# EasyEDA Pro project VS_Project_HW02.eprj

# Schematic VS_Schematic
Board Name: VS_Board; Create Date: 2025-04-22; Page Name: P1; Project Name: VS_Project_HW02; Schematic Name: VS_Schematic; Update Date: 2025-07-10; Company: OTCN; Page Size: A3; Version: V0.2
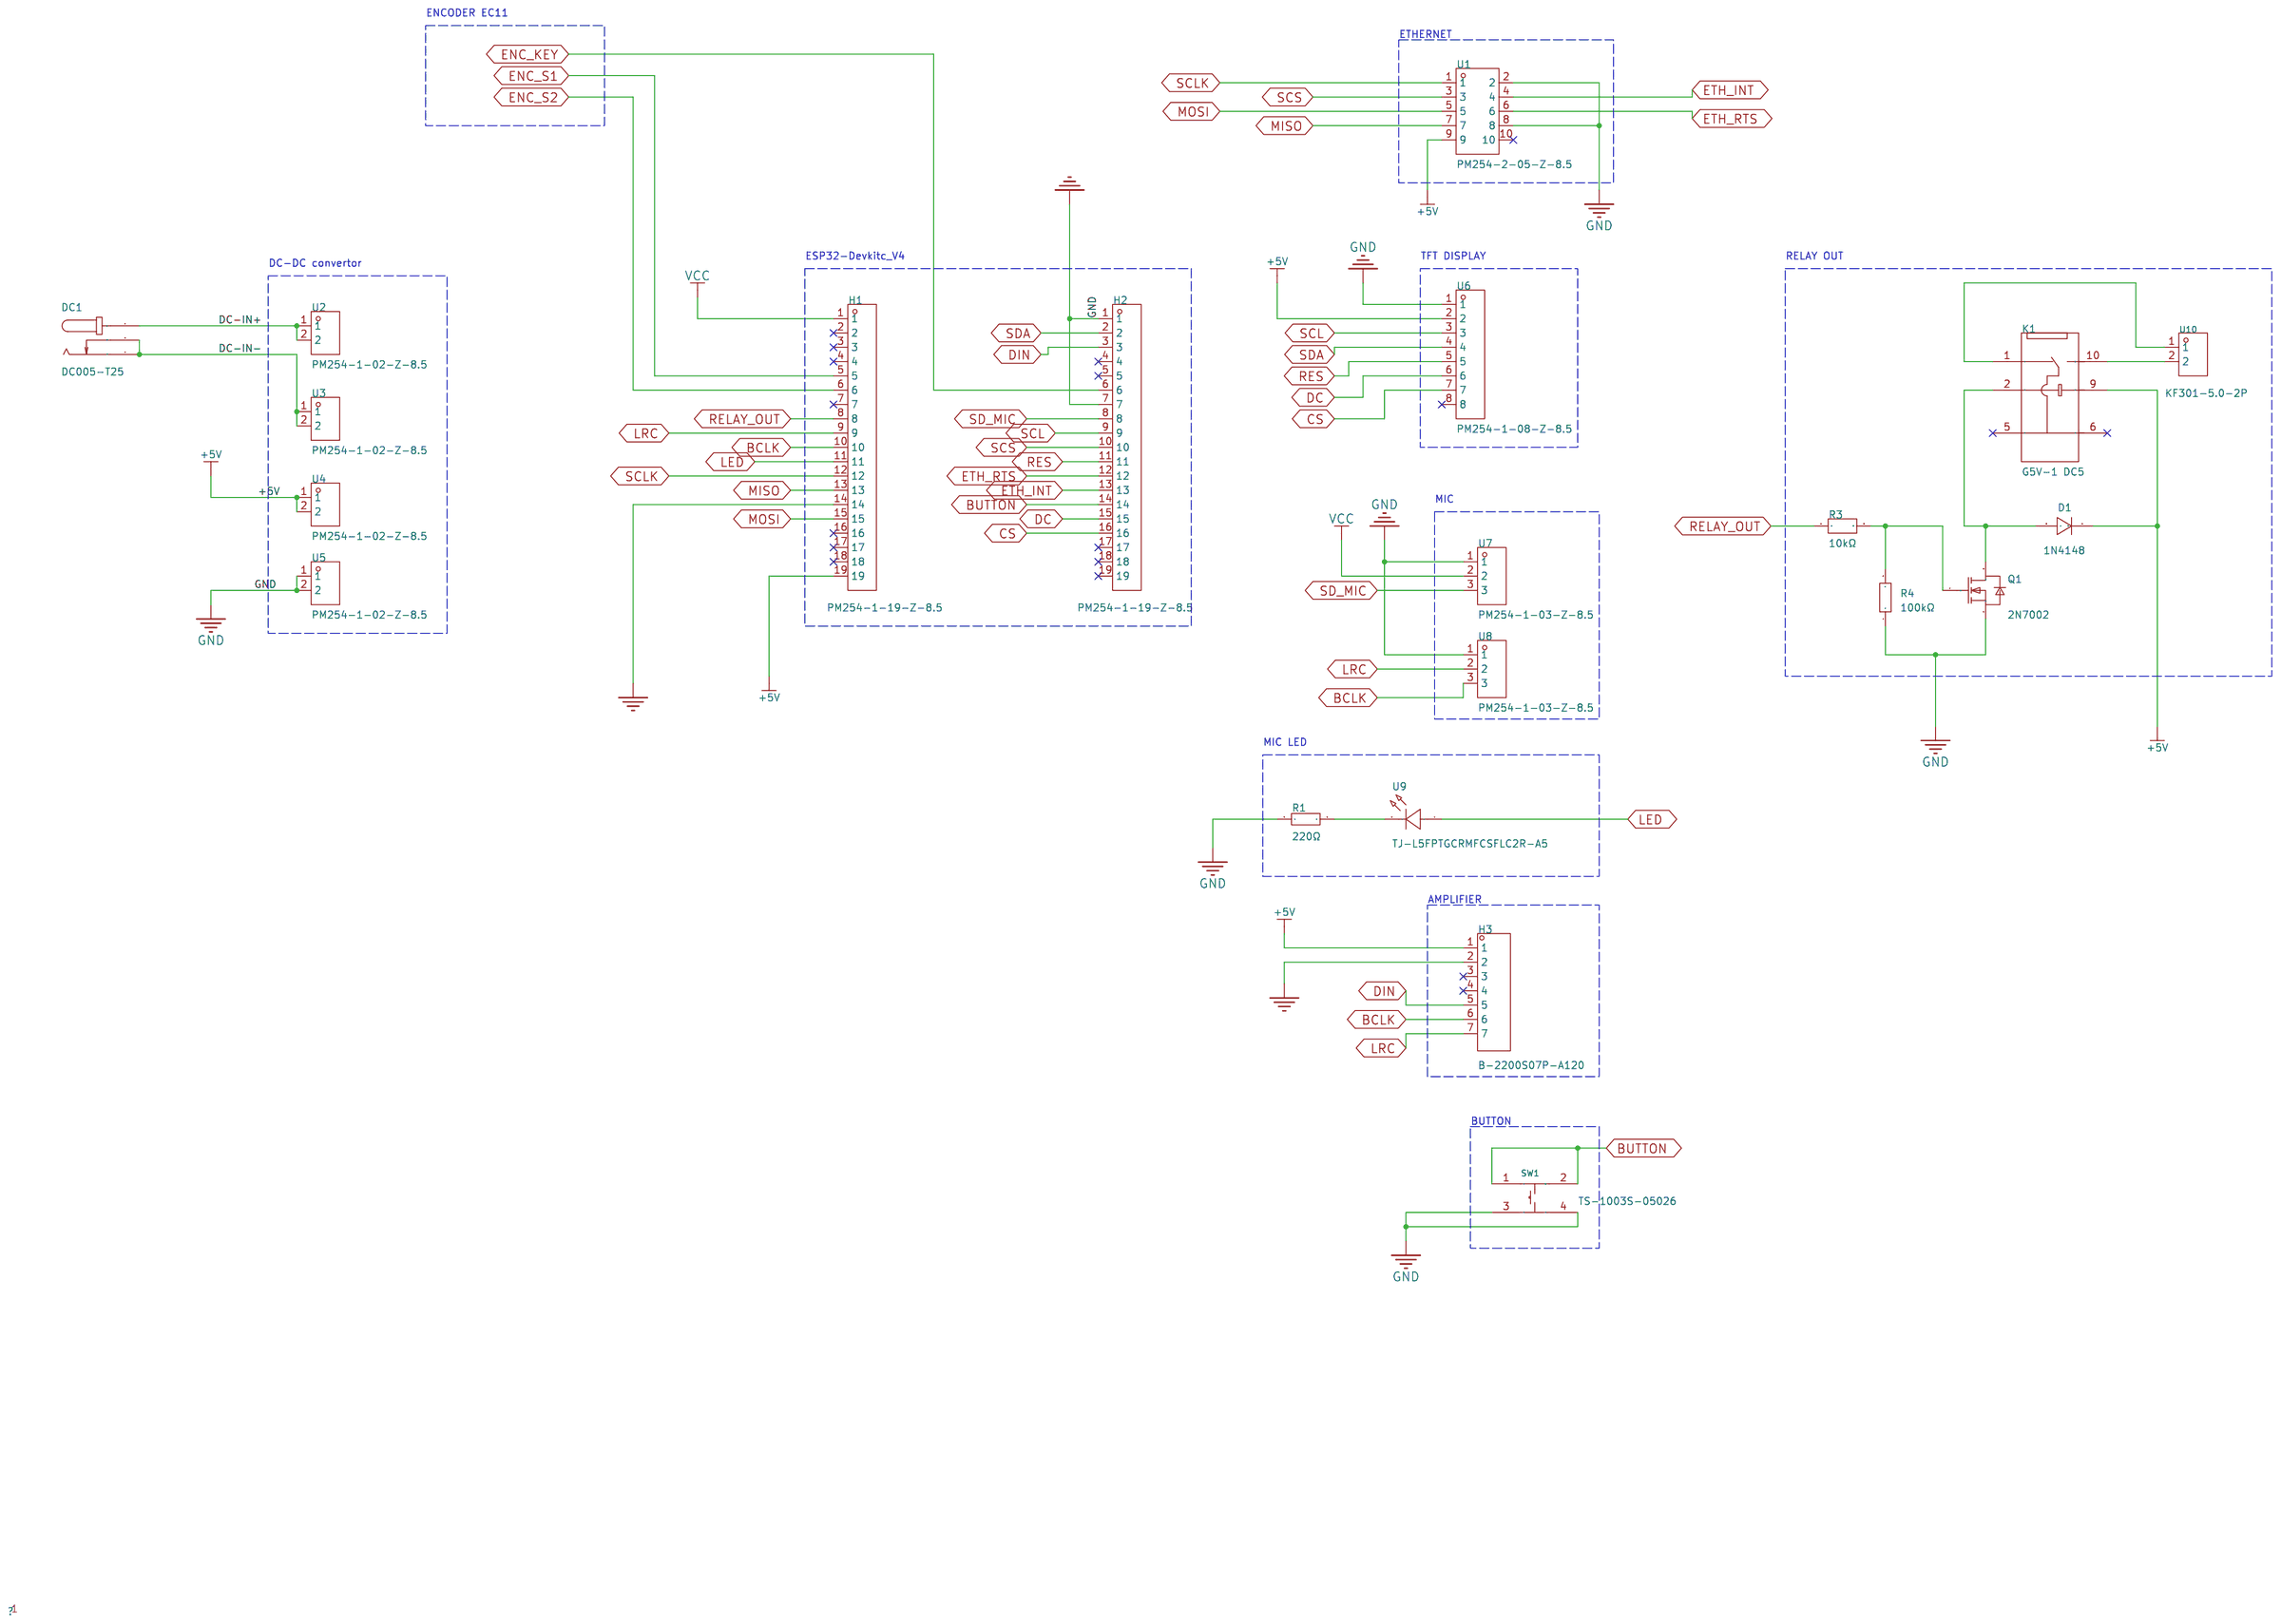
[diagram p0: schematic sheet]

## Parts
D1  1N4148  [DO-35_BD2.0-L4.2-P8.20-D0.5-RD]
DC1  DC005-T25  [DC-IN-TH_DC-005-20A-1]
H1  PM254-1-19-Z-8.5  [HDR-TH_19P-P2.54-V-F]
H2  PM254-1-19-Z-8.5  [HDR-TH_19P-P2.54-V-F]
H3  B-2200S07P-A120  [HDR-TH_7P-P2.54-V-F]
K1  G5V-1 DC5  [RELAY-TH_G5V-1]
Q1  2N7002  [SOT-23-3_L2.9-W1.3-P1.90-LS2.4-BR]
R1  220Ω  [R0603]
R3  10kΩ  [R0603]
R4  100kΩ  [R0603]
SW1  TS-1003S-05026  [KEY-SMD_4P-L12.0-W12.0-P5.00-LS15.2]
U1  PM254-2-05-Z-8.5  [HDR-TH_10P-P2.54-V-F-R2-C5-S2.54]
U2  PM254-1-02-Z-8.5  [HDR-TH_2P-P2.54-V-F]
U3  PM254-1-02-Z-8.5  [HDR-TH_2P-P2.54-V-F]
U4  PM254-1-02-Z-8.5  [HDR-TH_2P-P2.54-V-F]
U5  PM254-1-02-Z-8.5  [HDR-TH_2P-P2.54-V-F]
U6  PM254-1-08-Z-8.5  [HDR-TH_8P-P2.54-V-F]
U7  PM254-1-03-Z-8.5  [HDR-TH_3P-P2.54-V-F]
U8  PM254-1-03-Z-8.5  [HDR-TH_3P-P2.54-V-F]
U9  TJ-L5FPTGCRMFCSFLC2R-A5  [LED-TH_BD5.8-P2.54-FD]  (no BOM)
U10  KF301-5.0-2P  [CONN-TH_P5.00_KF301-5.0-2P]  (no BOM)

## Library data of the parts
D1 = 1N4148_C406389: LCSC Part Name: 电压:75V 电流:150mA; Supplier Part: C406389; Manufacturer: GOOD-ARK(固锝); Supplier Footprint: DO-35; JLCPCB Part Class: Extended Part; Datasheet: https://atta.szlcsc.com/upload/public/pdf/source/20190724/C406389_39EB15FF1EE68DC8E61740104CC090CC.pdf; Supplier: LCSC; Diode Configuration: Independent Type; Forward Voltage (Vf@If): 1V@10mA; Reverse Leakage Current: 5uA@75V; Check: true
DC1 = DC005-T25: LCSC Part Name: DC电源插座 内径:2.5mm 外径:6.3mm; Supplier Part: C111573; Manufacturer: SOFNG(硕方); Supplier Footprint: 插件; JLCPCB Part Class: Extended Part; Datasheet: https://atta.szlcsc.com/upload/public/pdf/source/20211217/AAF92010038535095742900872F779AE.pdf; Supplier: LCSC; Connector Type: DC Power Receptacle; Mounting Type: Bend-in; Inside Contact Diameter: 2.5mm; Outside Contact Diameter: 6.3mm; Current Rating: 3A; Voltage Rating (Max): 12V; Operating Temperature: -10℃~+60℃; Check: true
H1 H2 = PM254-1-19-Z-8.5: LCSC Part Name: 1x19P 间距:2.54mm 直插; Supplier Part: C2897382; Manufacturer: HCTL(华灿天禄); Supplier Footprint: 插件,P=2.54mm; JLCPCB Part Class: Extended Part; Datasheet: https://atta.szlcsc.com/upload/public/pdf/source/20230609/534BE42964C679BDE98E061007C4ABD6.pdf; Supplier: LCSC; Holes Structure: 1x19P; Pitch: 2.54mm; Circular Hole / Square Hole: Square Holes; Mounting Type: Straight; Number of Rows: Plugin; Number of Holes: 19P; Current Rating (Max): 3A; Holes Direction: Top; Insulation Height: 8.5mm; Contact Material: Copper Alloy; Operating Temperature Range: -40℃~+105℃; Soldering Temperature(Max): 260℃@5S; Check: true
H3 = B-2200S07P-A120: Holes Structure:1x7P Pitch:2.54mm Row Spacing:- Mounting Type:Straight Number of Rows:Plugin Number of Holes:7P Insulation Height:- Contact Material:Brass Contact Plating:-; LCSC Part Name: 间距:2.54mm 1x7P 直插; Supplier Part: C124418; Manufacturer: Ckmtw(灿科盟); Supplier Footprint: 插件,P=2.54mm; JLCPCB Part Class: Extended Part; Datasheet: https://atta.szlcsc.com/upload/public/pdf/source/20170821/C124418_1503303326113901572.pdf; Supplier: LCSC; Holes Structure: 1x7P; Pitch: 2.54mm; Mounting Type: Straight; Number of Rows: Plugin; Number of Holes: 7P; Contact Material: Brass; Check: true
K1 = G5V-1 DC5: Coil Voltage:5V Contact Form:One Conversion: 1C (SPDT-Conversion) Pin Number:- Contact Rating:- Maximum Switching Voltage:125V@AC；60V@DC Contact Material:silver+Gold plating Coil Resistance:- Maximum Switching Current:1A Operate Time:5ms Release Time:5ms; LCSC Part Name: 继电器G5V-1-5VDC; Supplier Part: C28695; Manufacturer: OMRON(欧姆龙); Supplier Footprint: DIP,7.5x12.5mm; JLCPCB Part Class: Extended Part; Datasheet: https://atta.szlcsc.com/upload/public/pdf/source/20220121/C1560795_CC5D06F4BC220E90EB05E847E60E1CD7.pdf; Supplier: LCSC; Coil Voltage: 5V; Contact Form: One Conversion: 1C (SPDT-Conversion); Maximum Switching Voltage: 125V@AC；60V@DC; Contact Material: silver+Gold plating; Maximum Switching Current: 1A; Operate Time: 5ms; Release Time: 5ms; Operating Temperature: -40℃~+70℃; Check: true
Q1 = 2N7002_1: Supplier Part: C42395051; Manufacturer: YFW(佑风微); Supplier Footprint: SOT-23; Datasheet: https://atta.szlcsc.com/upload/public/pdf/source/20250121/2026667300ABD65F313B4D2D7FD8D898.pdf; Supplier: LCSC; Number: 1 N-Channel; Drain to Source Voltage: 60V; RDS(on): 5Ω@10V,500mA; Pd - Power Dissipation: 225mW; Gate Threshold Voltage (Vgs(th)@Id): 1V; Input Capacitance(Ciss): 50pF; Reverse Transfer Capacitance (Crss@Vds): 5pF
R1 = RC0603FR-07220RL: Type:Thick Film Resistors Resistance: Tolerance:±1% Tolerance:±1% Power(Watts): Overload Voltage (Max): Temperature Coefficient:±100ppm/℃ Temperature Coefficient:±100ppm/℃ Operating Temperature Range:-55℃~+155℃ Operating Temperature Range:-55℃~+155℃; LCSC Part Name: 厚膜电阻 220Ω ±1% 100mW; Supplier Part: C107696; Manufacturer: YAGEO(国巨); Supplier Footprint: 0603; JLCPCB Part Class: Extended Part; Datasheet: https://atta.szlcsc.com/upload/public/pdf/source/20180821/C275644_0D56F95EFF785E7D9A1FEF436B37DA78.pdf; Supplier: LCSC; Type: Thick Film Resistors; Tolerance: ±1%; Temperature Coefficient: ±100ppm/℃; Operating Temperature Range: -55℃~+155℃
R3 = RC0603JR-0710KL: Type:Thick Film Resistors Resistance: Tolerance:±5% Tolerance:±5% Power(Watts): Overload Voltage (Max): Temperature Coefficient:±100ppm/℃ Temperature Coefficient:±100ppm/℃ Operating Temperature Range:-55℃~+155℃ Operating Temperature Range:-55℃~+155℃; LCSC Part Name: 厚膜电阻 10kΩ ±5% 100mW; Supplier Part: C99198; Manufacturer: YAGEO(国巨); Supplier Footprint: 0603; JLCPCB Part Class: Extended Part; Datasheet: https://atta.szlcsc.com/upload/public/pdf/source/20181223/C99198_917934A193F41F77D9F7D214A8C79116.pdf; Supplier: LCSC; Type: Thick Film Resistors; Tolerance: ±5%; Temperature Coefficient: ±100ppm/℃; Operating Temperature Range: -55℃~+155℃
R4 = RC0603FR-07100KL: Type:Thick Film Resistors Resistance: Tolerance:±1% Tolerance:±1% Power(Watts): Overload Voltage (Max): Temperature Coefficient:±100ppm/℃ Temperature Coefficient:±100ppm/℃ Operating Temperature Range:-55℃~+155℃ Operating Temperature Range:-55℃~+155℃; LCSC Part Name: 厚膜电阻 100kΩ ±1% 100mW; Supplier Part: C14675; Manufacturer: YAGEO(国巨); Supplier Footprint: 0603; JLCPCB Part Class: Extended Part; Datasheet: https://atta.szlcsc.com/upload/public/pdf/source/20140324/1457707028752.pdf; Supplier: LCSC; Type: Thick Film Resistors; Tolerance: ±1%; Temperature Coefficient: ±100ppm/℃; Operating Temperature Range: -55℃~+155℃
SW1 = TS-1003S-05026: LCSC Part Name: 12*12*5mm 立贴 轻触开关; Supplier Part: C455219; Manufacturer: XUNPU(讯普); Supplier Footprint: SMD,12x12mm; JLCPCB Part Class: Extended Part; Datasheet: https://atta.szlcsc.com/upload/public/pdf/source/20191118/C455233_8350A2262BDF54A6D5D6E1D36705B166.pdf; Supplier: LCSC; Circuit: SPST; Actuator Style: Round Button; Mounting Style: Brick nogging; Switch Length: 12mm; Switch Width: 12mm; Switch Height: 5mm; Contact Current: 50mA; Voltage Rating (DC): 12V; Check: true
U1 = PM254-2-05-Z-8.5: LCSC Part Name: 2x5P 间距:2.54mm 直插; Supplier Part: C2897406; Manufacturer: HCTL(华灿天禄); Supplier Footprint: 插件,P=2.54mm; JLCPCB Part Class: Extended Part; Datasheet: https://atta.szlcsc.com/upload/public/pdf/source/20230609/3D36CA2C1BFC9FD1C3F709AD9DFEB9C2.pdf; Supplier: LCSC; Holes Structure: 2x5P; Pitch: 2.54mm; Row Spacing: 2.54mm; Circular Hole / Square Hole: Square Holes; Mounting Type: Straight; Number of Rows: 双排; Number of Holes: 10P; Current Rating (Max): 3A; Holes Direction: Top; Insulation Height: 8.5mm; Contact Material: Copper Alloy; Operating Temperature Range: -40℃~+105℃; Soldering Temperature(Max): 260℃@5S; Check: true
U2-U5 = PM254-1-02-Z-8.5: LCSC Part Name: 1x2P 间距:2.54mm 直插; Supplier Part: C2897365; Manufacturer: HCTL(华灿天禄); Supplier Footprint: 插件,P=2.54mm; JLCPCB Part Class: Extended Part; Datasheet: https://atta.szlcsc.com/upload/public/pdf/source/20230609/534BE42964C679BDE98E061007C4ABD6.pdf; Supplier: LCSC; Holes Structure: 1x2P; Pitch: 2.54mm; Circular Hole / Square Hole: Square Holes; Mounting Type: Straight; Number of Rows: Plugin; Number of Holes: 2P; Current Rating (Max): 3A; Holes Direction: Top; Insulation Height: 8.5mm; Contact Material: Copper Alloy; Operating Temperature Range: -40℃~+105℃; Soldering Temperature(Max): 260℃@5S; Check: true
U6 = PM254-1-08-Z-8.5: LCSC Part Name: 1x8P 间距:2.54mm 直插; Supplier Part: C2897371; Manufacturer: HCTL(华灿天禄); Supplier Footprint: 插件,P=2.54mm; JLCPCB Part Class: Extended Part; Datasheet: https://atta.szlcsc.com/upload/public/pdf/source/20230609/534BE42964C679BDE98E061007C4ABD6.pdf; Supplier: LCSC; Holes Structure: 1x8P; Pitch: 2.54mm; Circular Hole / Square Hole: Square Holes; Mounting Type: Straight; Number of Rows: Plugin; Number of Holes: 8P; Current Rating (Max): 3A; Holes Direction: Top; Insulation Height: 8.5mm; Contact Material: Copper Alloy; Operating Temperature Range: -40℃~+105℃; Soldering Temperature(Max): 260℃@5S; Check: true
U7 U8 = PM254-1-03-Z-8.5: LCSC Part Name: 1x3P 间距:2.54mm 直插; Supplier Part: C2897366; Manufacturer: HCTL(华灿天禄); Supplier Footprint: 插件,P=2.54mm; JLCPCB Part Class: Extended Part; Datasheet: https://atta.szlcsc.com/upload/public/pdf/source/20230609/534BE42964C679BDE98E061007C4ABD6.pdf; Supplier: LCSC; Holes Structure: 1x3P; Pitch: 2.54mm; Circular Hole / Square Hole: Square Holes; Mounting Type: Straight; Number of Rows: Plugin; Number of Holes: 3P; Current Rating (Max): 3A; Holes Direction: Top; Insulation Height: 8.5mm; Contact Material: Copper Alloy; Operating Temperature Range: -40℃~+105℃; Soldering Temperature(Max): 260℃@5S; Check: true
U9 = TJ-L5FPTGCRMFCSFLC2R-A5: LCSC Part Name: 红灯; Supplier Part: C331030; Manufacturer: TOGIALED(统佳); Supplier Footprint: 插件,D=5mm; JLCPCB Part Class: Extended Part; Datasheet: https://atta.szlcsc.com/upload/public/pdf/source/20200630/C331030_22D81B7C20A1174897D0556DDDC6A8F3.pdf; Supplier: LCSC; Lamp Holder Type: 5mm圆柱形灯头; Emitted Color: Red; Lens Color: 雾状红透镜; Check: true
U10 = KF301-5.0-2P: LCSC Part Name: 5mm 1x2P 排数:1 每排P数:2 直插; Supplier Part: C474881; Manufacturer: KEFA(科发); Supplier Footprint: 插件,P=5mm; JLCPCB Part Class: Extended Part; Datasheet: https://atta.szlcsc.com/upload/public/pdf/source/20230317/03A5B5FC229D6F9225E8F51DA1A4E80A.pdf; Supplier: LCSC; Structure: 1x2P; Pitch: 5mm; Color: Blue; Mounting Style: Straight; Current Rating (Max): 17A; Voltage Rating (Max): 250V; Number of Pins: 2P; Number of Rows: 1; Wire Gauge - AWG: 14~22; Wire Gauge - mm2: 1.5; Number of PINs Per Row: 2; Operating Temperature Range: -30℃~+120℃; Check: true

## Nets
+5V: D1.1(C) H1.19 H3.1 K1.9 U1.9 U4.1 U4.2 U6.2
GND: H1.14 H2.1 H2.7 H3.2 Q1.2(S) R1.1 R4.1 SW1.3 SW1.4 U1.2 U1.8 U5.1 U5.2 U6.1 U7.1 U8.1
VCC: H1.1 U7.2
BCLK: H1.10 H3.6 U8.3
BUTTON: H2.14 SW1.1 SW1.2
CS: H2.16 U6.7
DC: H2.15 U6.6
DC-IN+: DC1.1 U2.1 U2.2
DC-IN-: DC1.2 DC1.3 U3.1 U3.2
DIN: H2.3 H3.5
ENC_KEY: H2.6
ENC_S1: H1.5
ENC_S2: H1.6
ETH_INT: H2.13 U1.4
ETH_RTS: H2.12 U1.6
LED: H1.11 U9.1(A)
LED_GND: R1.2 U9.2(K)
LRC: H1.9 H3.7 U8.2
MISO: H1.13 U1.7
MOSI: H1.15 U1.5
Q1_DRAIN: D1.2(A) K1.2 Q1.3(D)
Q1_GATE: Q1.1(G) R3.2 R4.2
RELAY_OUT: H1.8 R3.1
RES: H2.11 U6.5
SCL: H2.9 U6.3
SCLK: H1.12 U1.1
SCS: H2.10 U1.3
SD_MIC: H2.8 U7.3
SDA: H2.2 U6.4
U10_1: K1.1 U10.1
U10_2: K1.10 U10.2

Not connected (* = marked no-connect by the designer): H1 2* 3* 4* 7* 16* 17* 18*; H2 4* 5* 17* 18* 19*; H3 3* 4*; K1 5* 6*; U1 10*; U6 8*

## Notes on the sheet
- ENCODER EC11
- ETHERNET
- DC-DC convertor
- ESP32-Devkitc_V4
- TFT DISPLAY
- RELAY OUT
- MIC
- MIC LED
- AMPLIFIER
- BUTTON

# Board VS_PCB
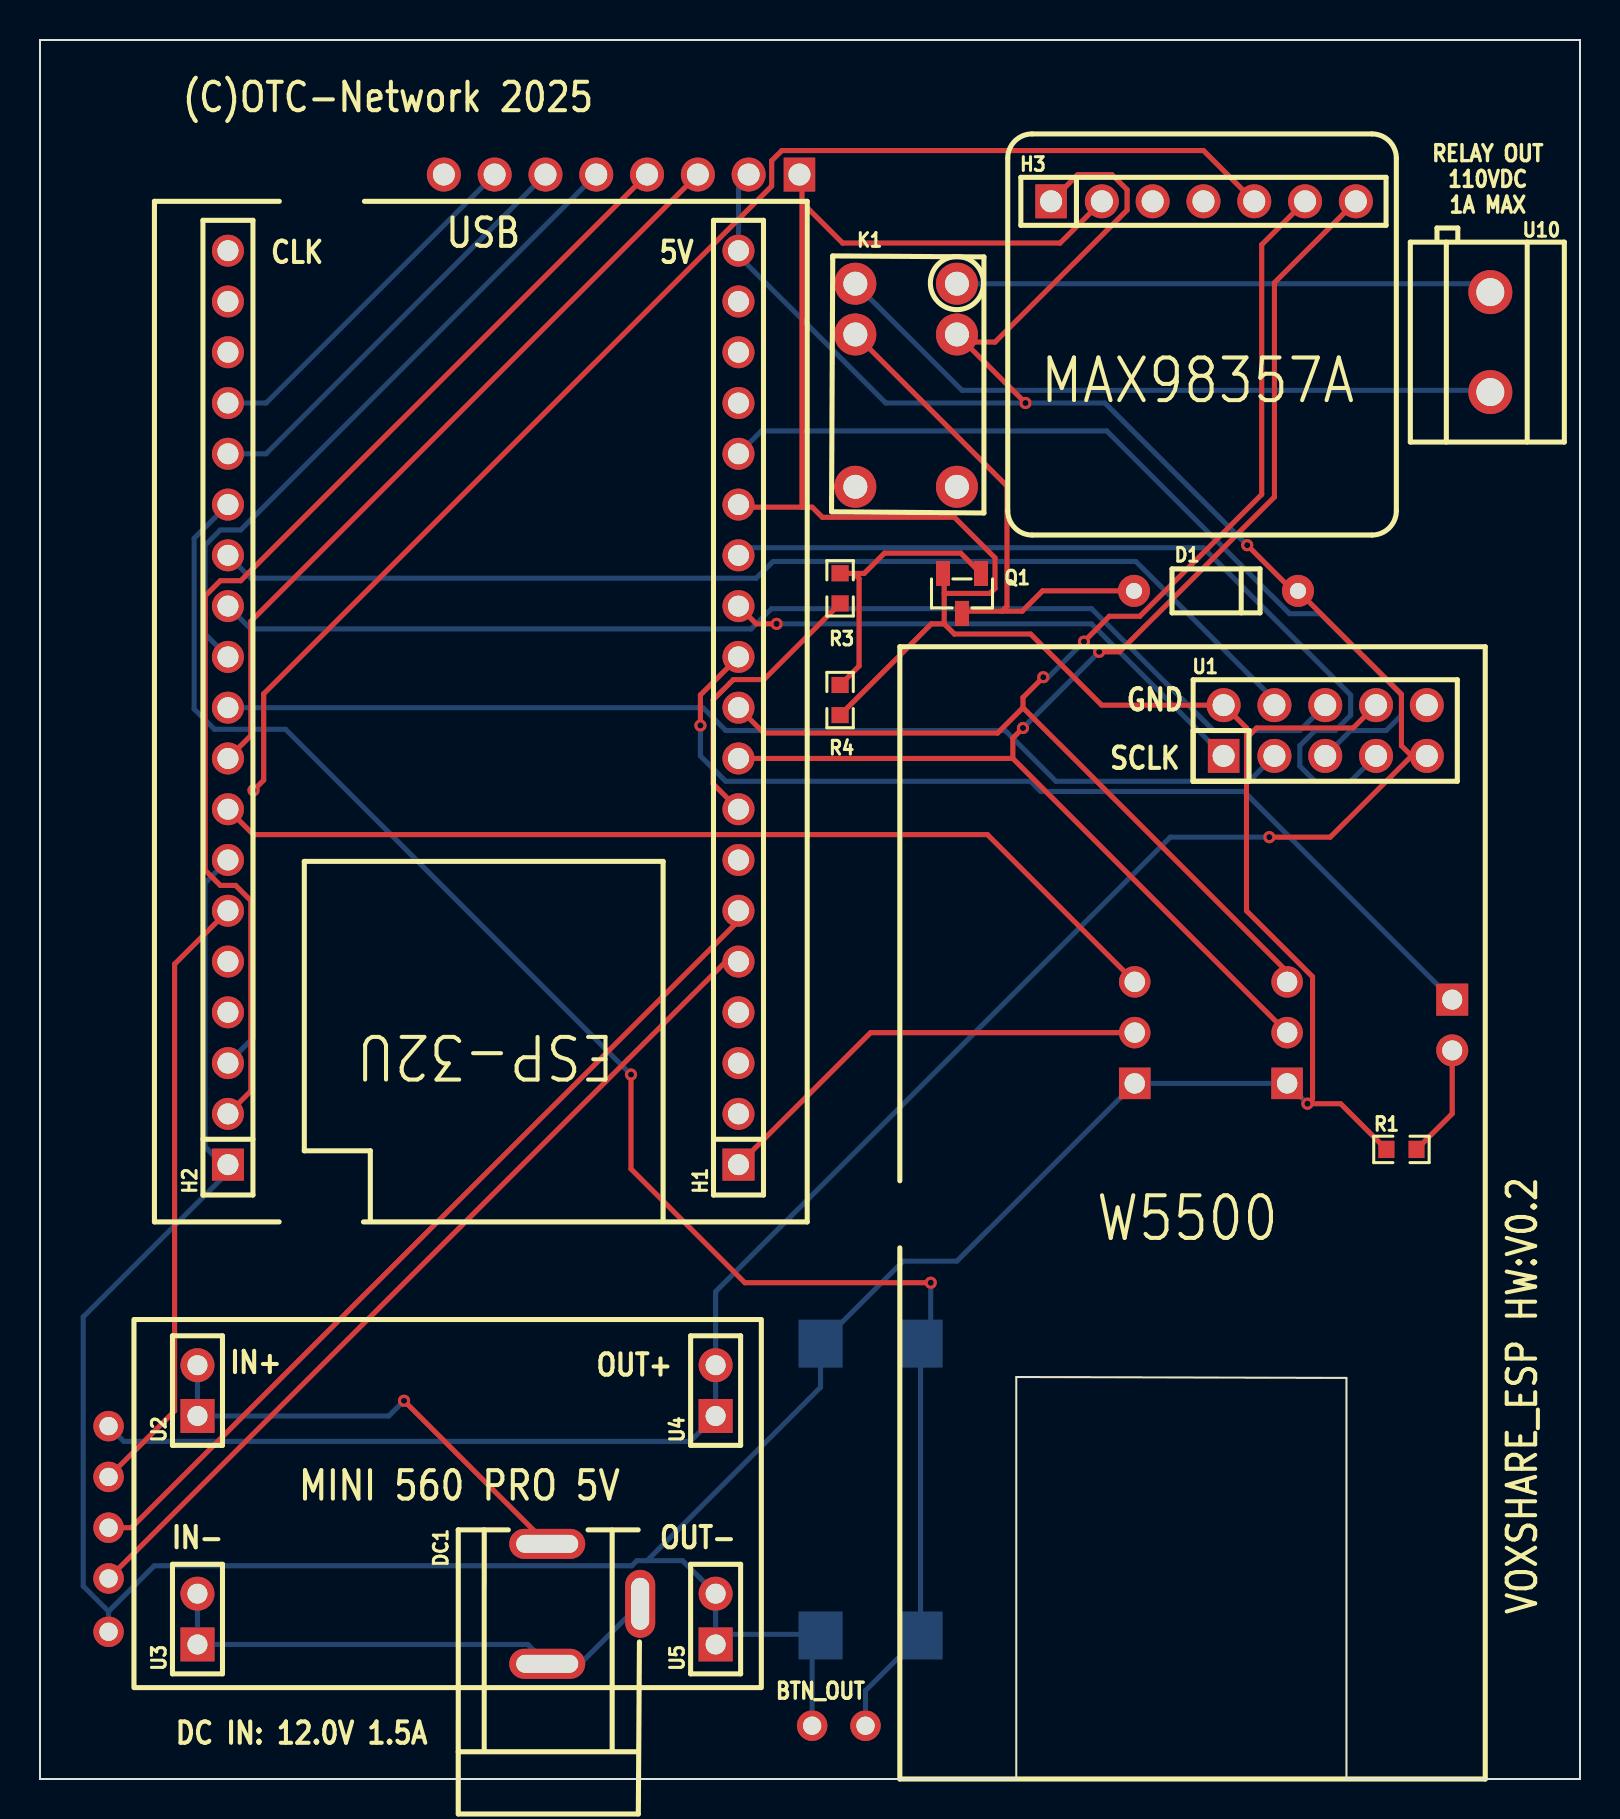
[diagram p1: board, top side]
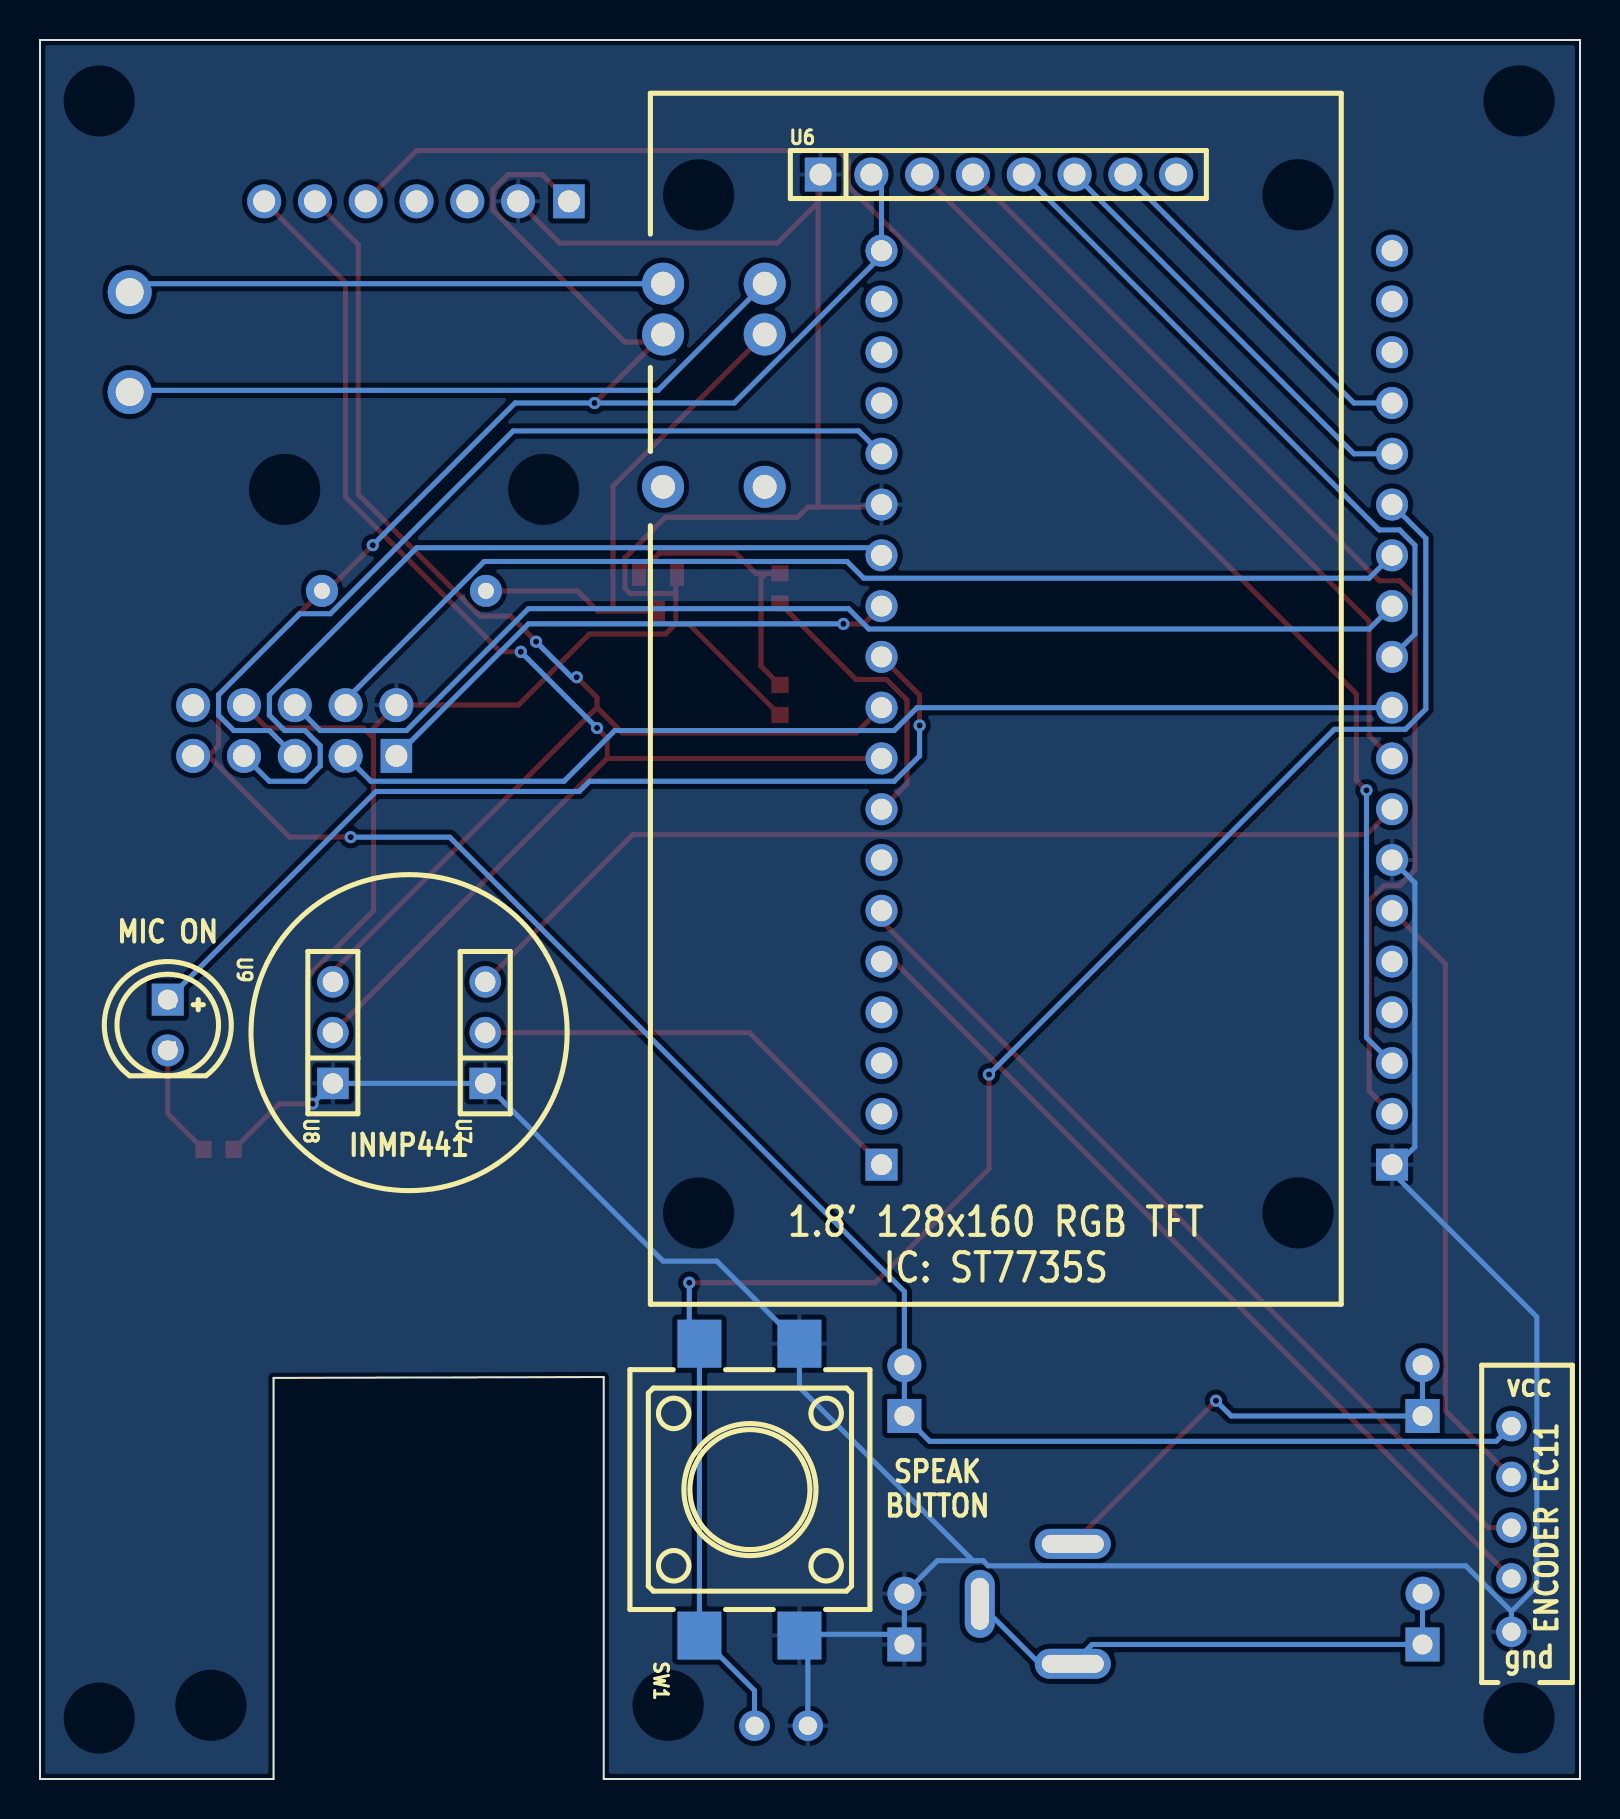
[diagram p2: board, bottom side, seen from below]

Outline 77 x 87 mm; copper layers: Top Layer, Bottom Layer. Coordinates in mm from the lower left corner of the outline.
Outline path: 0,87 77,87 77,0 65.32,0 65.32,20.07 48.81,20.11 48.81,0 0,0 0,87
Stack: Top Layer 0.035mm / Dielectric1 1.51mm FR4 er 4.5 / Bottom Layer 0.035mm

## Design rules (mm)
template: JLCPCB Capability(Two Layers Board)
spacing copperThickness1oz (default): track to track 0.102, other pairs 0.152 to 0.3
spacing copperThickness2oz: track to track 0.203, other pairs 0.152 to 0.3
track width copperThickness1oz (default): min 0.127, default 0.254, max 2.54
track width copperThickness2oz: min 0.203, default 0.254, max 2.54
differential pair differentialPair (default): width min 0.127, default 0.254, max 2.54; gap min 0.152, default 0.152
via viaSize (default): diameter min 0.5, default 0.61, max 10; hole min 0.3, default 0.305, max 6.3

## Placement (name value [footprint] x y rotation side)
D1  1N4148  [DO-35_BD2.0-L4.2-P8.20-D0.5-RD]  58.8 59.44 180 top
DC1  DC005-T25  [DC-IN-TH_DC-005-20A-1]  27.69 8.76 90 top
H1  PM254-1-19-Z-8.5  [HDR-TH_19P-P2.54-V-F]  34.92 53.59 90 top
H2  PM254-1-19-Z-8.5  [HDR-TH_19P-P2.54-V-F]  9.4 53.59 90 top
H3  B-2200S07P-A120  [HDR-TH_7P-P2.54-V-F]  58.17 78.92 0 top
K1  G5V-1 DC5  [RELAY-TH_G5V-1]  43.31 69.72 270 top
NOREF  -  [Pad_e453]  3.43 17.65 0 top
NOREF#2  -  [Pad_e457]  3.43 7.37 0 top
NOREF#3  -  [Pad_e14466]  41.28 2.67 0 top
NOREF#4  -  [Pad_e14465]  38.61 2.67 0 top
NOREF#5  -  [Pad_e454]  3.43 15.11 0 top
NOREF#6  -  [Pad_e455]  3.43 12.57 0 top
NOREF#7  -  [Pad_e456]  3.43 10.03 0 top
Q1  2N7002  [SOT-23-3_L2.9-W1.3-P1.90-LS2.4-BR]  46.1 59.31 90 top
R1  220Ω  [R0603]  68.07 31.5 0 top
R3  10kΩ  [R0603]  40 59.56 90 top
R4  100kΩ  [R0603]  40 53.98 90 top
SW1  TS-1003S-05026  [KEY-SMD_4P-L12.0-W12.0-P5.00-LS15.2]  41.53 14.48 90 bottom
U1  PM254-2-05-Z-8.5  [HDR-TH_10P-P2.54-V-F-R2-C5-S2.54]  64.26 52.45 0 top
U2  PM254-1-02-Z-8.5  [HDR-TH_2P-P2.54-V-F]  7.87 19.43 90 top
U3  PM254-1-02-Z-8.5  [HDR-TH_2P-P2.54-V-F]  7.87 8 90 top
U4  PM254-1-02-Z-8.5  [HDR-TH_2P-P2.54-V-F]  33.78 19.43 90 top
U5  PM254-1-02-Z-8.5  [HDR-TH_2P-P2.54-V-F]  33.78 8 90 top
U6  PM254-1-08-Z-8.5  [HDR-TH_8P-P2.54-V-F]  29.08 80.26 180 bottom
U7  PM254-1-03-Z-8.5  [HDR-TH_3P-P2.54-V-F]  54.74 37.34 90 bottom
U8  PM254-1-03-Z-8.5  [HDR-TH_3P-P2.54-V-F]  62.36 37.34 90 bottom
U9  TJ-L5FPTGCRMFCSFLC2R-A5  [LED-TH_BD5.8-P2.54-FD]  70.61 37.72 270 bottom
U10  KF301-5.0-2P  [CONN-TH_P5.00_KF301-5.0-2P]  72.52 71.88 90 top

## Footprints (pads in the part's own frame, mm; a bottom-side part is the same pattern mirrored in y, then rotated)
CONN-TH_P5.00_KF301-5.0-2P
  round 2.2 hole 1.4: 1(-2.5,0) 2(2.5,0)
DC-IN-TH_DC-005-20A-1
  oval 1.5x3.8 hole 0.9x3.1: 1(3,2.325) 2(-3,2.325)
  oval 3.4x1.5 hole 2.6x0.9: 3(0,-2.325)
DO-35_BD2.0-L4.2-P8.20-D0.5-RD
  round 1.6 hole 0.8: 1(-4.1,0) 2(4.1,0)
HDR-TH_2P-P2.54-V-F
  rect 1.7x1.7 hole 1: 1(-1.27,0)
  round 1.7 hole 1: 2(1.27,0)
HDR-TH_3P-P2.54-V-F
  rect 1.575x1.575 hole 1.02: 1(-2.54,0)
  round 1.575 hole 1.02: 2(0,0) 3(2.54,0)
HDR-TH_7P-P2.54-V-F
  rect 1.575x1.7 hole 1.1: 1(-7.62,0)
  round 1.7 hole 1.1: 2(-5.08,0) 3(-2.54,0) 4(0,0) 5(2.54,0) 6(5.08,0) 7(7.62,0)
HDR-TH_8P-P2.54-V-F
  rect 1.575x1.7 hole 1.1: 1(-8.89,0)
  round 1.7 hole 1.1: 2(-6.35,0) 3(-3.81,0) 4(-1.27,0) 5(1.27,0) 6(3.81,0) 7(6.35,0) 8(8.89,0)
HDR-TH_10P-P2.54-V-F-R2-C5-S2.54
  rect 1.575x1.7 hole 1.1: 1(-5.08,-1.27)
  round 1.7 hole 1.1: 2(-5.08,1.27) 3(-2.54,-1.27) 4(-2.54,1.27) 5(0,-1.27) 6(0,1.27) 7(2.54,-1.27) 8(2.54,1.27) 9(5.08,-1.27) 10(5.08,1.27)
HDR-TH_19P-P2.54-V-F
  rect 1.6x1.6 hole 1.05: 1(-22.86,0)
  round 1.6 hole 1.05: 2(-20.32,0) 3(-17.78,0) 4(-15.24,0) 5(-12.7,0) 6(-10.16,0) 7(-7.62,0) 8(-5.08,0) 9(-2.54,0) 10(0,0) 11(2.54,0) 12(5.08,0) 13(7.62,0) 14(10.16,0) 15(12.7,0) 16(15.24,0) 17(17.78,0) 18(20.32,0) 19(22.86,0)
KEY-SMD_4P-L12.0-W12.0-P5.00-LS15.2
  rect 2.4x2.2 smd: 1(-7.3,2.5) 2(7.3,2.5) 3(-7.3,-2.5) 4(7.3,-2.5)
LED-TH_BD5.8-P2.54-FD
  rect 1.6x1.6 hole 1: 1(-1.27,0)
  round 1.6 hole 1: 2(1.27,0)
Pad_e453
  round 1.524 hole 0.914: 1(0,0)
Pad_e454
  round 1.524 hole 0.914: 2(0,0)
Pad_e455
  round 1.524 hole 0.914: 3(0,0)
Pad_e456
  round 1.524 hole 0.914: 4(0,0)
Pad_e457
  round 1.524 hole 0.914: 5(0,0)
Pad_e14465
  round 1.524 hole 0.914: 1(0,0)
Pad_e14466
  round 1.524 hole 0.914: 2(0,0)
R0603
  rect 0.806x0.864 smd: 1(-0.753,0) 2(0.753,0)
RELAY-TH_G5V-1
  round 2.1 hole 1.2: 1(-5.08,-2.54) 2(-2.54,-2.54) 5(5.08,-2.54) 6(5.08,2.54) 9(-2.54,2.54) 10(-5.08,2.54)
SOT-23-3_L2.9-W1.3-P1.90-LS2.4-BR
  rect 1.25x0.7 smd: 1(1,-0.95) 2(1,0.95) 3(-1,0)

## Nets
As in the schematic, except:
+5V: D1.1 H1.19 H3.1 K1.9 NOREF.1 U1.9 U4.1 U4.2 U6.2
GND: H1.14 H2.1 H2.7 H3.2 NOREF#2.5 NOREF#4.1 Q1.2 R1.1 R4.1 SW1.3 SW1.4 U1.2 U1.8 U5.1 U5.2 U6.1 U7.1 U8.1
BUTTON: H2.14 NOREF#3.2 SW1.1 SW1.2
ENC_KEY: H2.6 NOREF#5.2
ENC_S1: H1.5 NOREF#7.4
ENC_S2: H1.6 NOREF#6.3

Pads without a net: H1 2 3 4 7 16 17 18; H2 4 5 17 18 19; H3 3 4; K1 5 6; U1 10; U6 8

## Via types
v1: diameter 0.61, hole 0.305, Top Layer to Bottom Layer, 14 vias

## Routing (per net, layer and track width the routed paths; a pad name or vN(x,y) marks a point on that pad's centre or on a via; arc(x,y) is an arc through that point)
+5V: length 155.3
  Top Layer w0.254: v1(49.28,68.83) 46.23,71.88 ; 46.23,71.88 47.75,71.88 54.36,78.49 54.36,79.5 53.59,80.26 51.89,80.26 H3.1 ; 46.23,71.88 K1.9 ; v1(61.47,47.12) 64.52,47.12 68.58,51.18 ; v1(60.36,61.72) 62.65,59.44 D1.1 68.07,54.27 68.07,51.69 68.58,51.18 ; 68.58,51.18 U1.9
  Bottom Layer w0.254: v1(60.36,61.72) 53.25,68.83 v1(49.28,68.83) 42.29,68.83 34.92,76.2 H1.19 34.92,79.76 U6.2 ; NOREF.1 4.19,16.89 32.51,16.89 U4.1 U4.2 33.78,24.38 56.51,47.12 v1(61.47,47.12)
GND: length 243
  Top Layer w0.254: 45.21,59.31 47.5,59.31 47.75,59.56 47.75,61.09 45.72,63.12 39.12,63.12 38.61,63.63 38.1,63.63 ; 45.21,59.31 45.21,60.25 Q1.2 ; 45.21,59.31 45.21,57.79 ; 60.32,52.07 60.32,52.58 U1.2 53.09,53.72 49.53,57.28 45.72,57.28 45.21,57.79 ; 60.32,52.07 60.32,43.43 63.63,40.13 63.63,34.04 v1(63.37,33.78) 65.03,33.78 R1.1 ; 60.32,52.07 60.83,52.58 65.66,52.58 U1.8 ; U6.1 38.1,80.14 38.1,78.87 ; R4.1 44.57,57.79 45.21,57.79 ; 38.1,63.63 35.05,63.63 H1.14 ; 38.1,63.63 38.1,78.87 ; 38.1,78.87 40.13,76.84 51,76.84 53.09,78.92
  Bottom Layer w0.254: 9.27,30.61 H2.1 ; 9.27,30.61 8.25,31.62 8.25,44.83 9.4,45.97 ; 9.27,30.61 9.27,30.23 2.16,23.11 2.16,9.65 3.43,8.38 ; 38.61,7.24 NOREF#4.1 ; 38.61,7.24 33.78,7.24 ; 38.61,7.24 38.97,7.24 SW1.3 ; 33.78,7.24 U5.2 32.13,10.92 30.35,10.92 ; 33.78,7.24 U5.1 ; 30.35,10.92 29.84,10.92 29.59,10.67 5.71,10.67 3.43,8.38 ; 30.35,10.92 39.03,19.6 SW1.4 43.16,25.91 45.85,25.91 54.74,34.8 62.36,34.8 v1(63.37,33.78) ; NOREF#2.5 3.43,8.38
VCC: length 22.5
  Top Layer w0.254: H1.1 41.53,37.34 U7.2
BCLK: length 66.7
  Top Layer w0.254: v1(50.16,55.12) 49.15,54.1 49.15,53.59 ; 49.15,53.59 62.36,40.39 U8.3 ; 49.15,53.59 47.88,52.32 36.19,52.32 H1.10 ; H3.6 61.09,76.76 61.09,64.26 54.99,58.17 53.47,58.17 v1(52.2,56.9)
  Bottom Layer w0.254: v1(52.2,56.9) 50.42,55.12 v1(50.16,55.12)
BUTTON: length 85.9
  Top Layer w0.254: v1(44.54,24.83) 35.25,24.83 29.55,30.52 v1(29.55,35.24)
  Bottom Layer w0.254: v1(44.54,24.83) 44.54,22.29 SW1.2 SW1.1 41.28,4.42 NOREF#3.2 ; H2.14 7.71,62.06 7.71,53.53 8.72,52.51 12.28,52.51 v1(29.55,35.24)
CS: length 18.1
  Bottom Layer w0.254: 9.4,68.83 11.3,68.83 U6.7
DC: length 21.7
  Bottom Layer w0.254: U6.6 11.3,66.29 H2.15
DC-IN+: length 23.3
  Top Layer w0.254: v1(18.2,18.92) DC1.1
  Bottom Layer w0.254: v1(18.2,18.92) 17.44,18.16 U2.1 U2.2
DC-IN-: length 26.3
  Bottom Layer w0.254: DC1.3 27.01,5.76 DC1.2 24.39,6.73 U3.1 U3.2
DIN: length 81.8
  Top Layer w0.254: v1(10.68,49.46) 11.18,49.97 11.18,54.29 36.58,79.69 36.58,80.96 37.09,81.46 58.17,81.46 H3.5
  Bottom Layer w0.254: v1(10.68,49.46) 10.68,37.09 H2.3
ENC_KEY: length 30.8
  Top Layer w0.254: NOREF#5.2 6.73,18.42 6.73,40.77 H2.6
ENC_S1: length 44.3
  Top Layer w0.254: H1.5 34.29,40.89 NOREF#7.4
ENC_S2: length 44.6
  Top Layer w0.254: NOREF#6.3 4.57,12.57 34.8,42.8 34.8,43.31 H1.6
ETH_INT: length 56.3
  Bottom Layer w0.254: U1.4 61.72,53.98 54.79,60.91 36.65,60.91 35.81,60.07 10.54,60.07 H2.13
ETH_RTS: length 58.8
  Bottom Layer w0.254: H2.12 10.54,57.53 35.56,57.53 36.58,58.55 52.58,58.55 58.67,52.45 62.99,52.45 U1.6
LED: length 48.4
  Top Layer w0.254: v1(33.02,52.71) 33.02,54.23 H1.11
  Bottom Layer w0.254: U9.1 60.2,49.4 50.04,49.4 49.53,49.91 34.29,49.91 33.02,51.18 v1(33.02,52.71)
LED_GND: length 5.7
  Top Layer w0.254: U9.2 70.61,33.28 R1.2
LRC: length 68.7
  Top Layer w0.254: H3.7 61.72,74.85 61.72,64.14 53.97,56.39 v1(52.96,56.39) ; 48.64,51.05 34.92,51.05 ; 48.64,51.05 U8.2 ; 48.64,51.05 48.64,52.07 v1(49.15,52.58)
  Bottom Layer w0.254: v1(49.15,52.58) v1(52.96,56.39)
MISO: length 43.7
  Bottom Layer w0.254: U1.7 65.53,49.91 63.75,49.91 62.99,50.67 62.99,51.69 63.75,52.45 64.77,52.45 65.53,53.21 65.53,54.23 58.17,61.6 35.31,61.6 H1.13
MOSI: length 44.8
  Bottom Layer w0.254: U1.5 65.53,52.45 67.31,52.45 68.07,53.21 68.07,54.23 64.01,58.29 62.48,58.29 53.34,67.44 36.07,67.44 H1.15
Q1_DRAIN: length 26.2
  Top Layer w0.254: D1.2 50.13,59.44 49.11,58.42 48.1,58.42 ; 48.1,58.42 48.35,58.67 48.35,64.68 K1.2 ; 48.1,58.42 46.21,58.42 Q1.3
Q1_GATE: length 14
  Top Layer w0.254: 40.7,60.31 40.95,60.06 40.95,55.68 40,54.73 ; 40.7,60.31 40.01,60.31 40,60.32 ; 40.7,60.31 41.21,60.31 42.22,61.33 46.03,61.33 Q1.1
RELAY_OUT: length 14.3
  Top Layer w0.254: H1.8 33.66,49.78 33.66,53.98 34.67,55 36.19,55 R3.1
RES: length 33.3
  Bottom Layer w0.254: U6.5 10.03,62.48 9.02,62.48 8.25,61.72 8.25,57.28 H2.11
SCL: length 38.9
  Top Layer w0.254: U6.3 10.54,57.91 10.54,52.2 9.4,51.05
SCLK: length 27.4
  Top Layer w0.254: v1(36.83,57.79) 35.81,57.79 H1.12
  Bottom Layer w0.254: U1.1 52.58,57.79 v1(36.83,57.79)
SCS: length 54.4
  Bottom Layer w0.254: H2.10 33.15,53.59 34.29,52.45 48.26,52.45 50.8,49.91 60.45,49.91 U1.3
SD_MIC: length 48.9
  Top Layer w0.254: H2.8 10.67,47.24 47.37,47.24 U7.3
SDA: length 58.6
  Top Layer w0.254: 9.4,33.27 10.54,34.42 10.54,43.94 9.78,44.7 9.02,44.7 8.25,45.47 8.25,59.18 9.02,59.94 10.03,59.94 U6.4
U10_1: length 34
  Bottom Layer w0.254: U10.1 72.43,69.47 46.1,69.47 K1.1
U10_2: length 26.8
  Bottom Layer w0.254: U10.2 72.1,74.8 K1.10

## Copper pours and planes (outline as drawn; the poured copper is in the pictures)
GND on Bottom Layer: 77,0 77,87 0,87 0,0 48.81,0 48.81,19.98 65.32,19.94 65.32,0

## Text on the board
Bottom Silkscreen Layer: ENCODER EC11 | vcc | gnd | SPEAK / BUTTON | INMP441 | MIC ON | 1.8' 128x160 RGB TFT / IC: ST7735S
Top Silkscreen Layer: RELAY OUT / 110VDC / 1A MAX | BTN_OUT | CLK | 5V | DC IN: 12.0V 1.5A | OUT- | SCLK | GND | IN- | OUT+ | IN+ | MINI 560 PRO 5V | USB | (C)OTC-Network 2025 | VOXSHARE_ESP HW:V0.2 | MAX98357A | W5500 | ESP-32U
